# EAGLE design untitled (EAGLE 7.7.0)
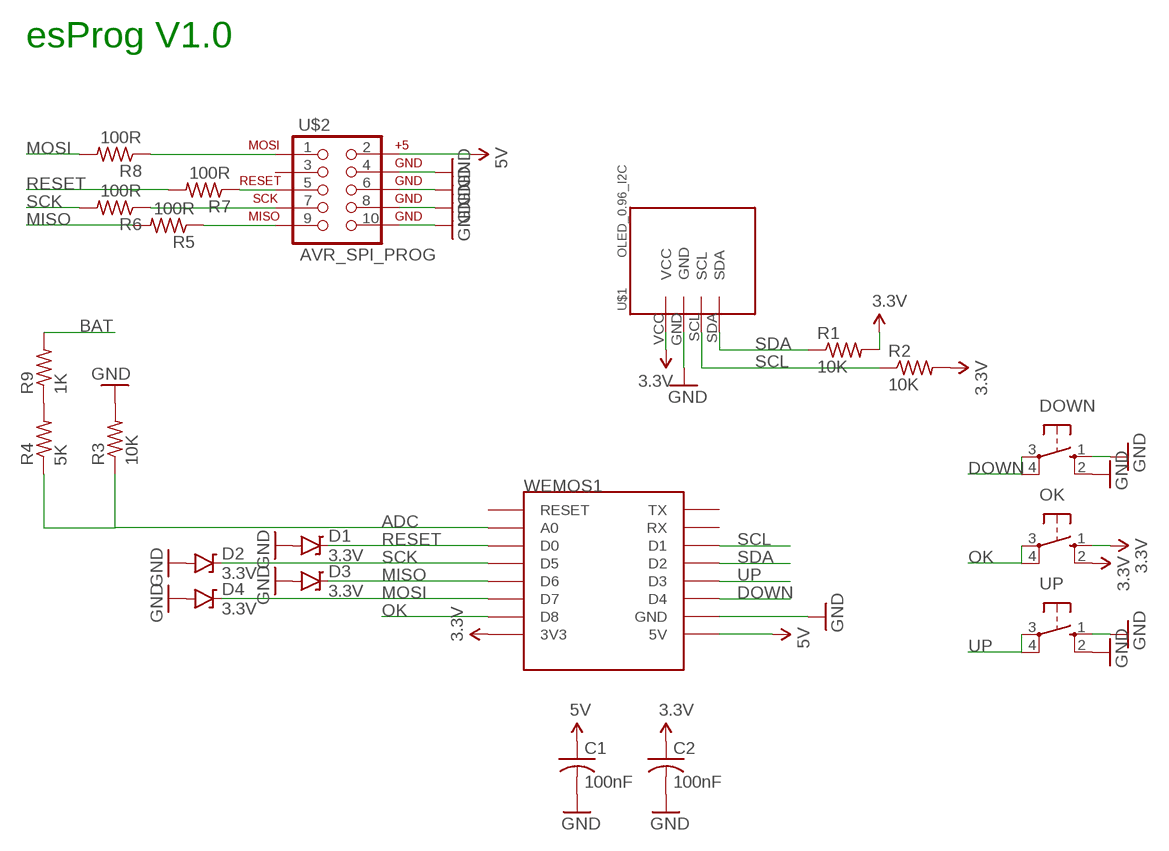
[diagram p0: schematic, sheet 1]

## Parts
C1  100nF  C-USC0805K  [C0805K]
C2  100nF  C-USC0805K  [C0805K]
D1  3.3V  DIODE-ZENER3.3V  [SOD-323]
D2  3.3V  DIODE-ZENER3.3V  [SOD-323]
D3  3.3V  DIODE-ZENER3.3V  [SOD-323]
D4  3.3V  DIODE-ZENER3.3V  [SOD-323]
DOWN  10-XX  [B3F-10XX]
OK  10-XX  [B3F-10XX]
R1  10K  R-US_R0805  [R0805]
R2  10K  R-US_R0805  [R0805]
R3  10K  R-US_R0805  [R0805]
R4  5K  R-US_R0805  [R0805]
R5  100R  R-US_R0805  [R0805]
R6  100R  R-US_R0805  [R0805]
R7  100R  R-US_R0805  [R0805]
R8  100R  R-US_R0805  [R0805]
R9  1K  R-US_R0805  [R0805]
U$1  OLED_0.96_I2C  [OLED_0.96_I2C]
U$2  AVR_SPI_PROG  [AVR_ICSP]
UP  10-XX  [B3F-10XX]
WEMOS1  WEMOS-D1-MINI  [WEMOS-D1-MINI]

## Nets
3.3V: C2.1 OK.1(S) OK.2(S1) R1.2 R2.2 U$1.VCC WEMOS1.3V3
5V: C1.1 U$2.2 WEMOS1.5V
ADC: R3.1 R4.1 WEMOS1.A0
BAT: R9.2
DOWN: DOWN.3(P) DOWN.4(P1) WEMOS1.D4
GND: C1.2 C2.2 D1.A D2.A D3.A D4.A DOWN.1(S) DOWN.2(S1) R3.2 U$1.GND U$2.4 U$2.6 U$2.8 U$2.10 UP.1(S) UP.2(S1) WEMOS1.GND
MISO: D3.C R5.2 WEMOS1.D6
MOSI: D4.C R8.2 WEMOS1.D7
N$1: R8.1 U$2.1
N$2: R7.1 U$2.5
N$3: R6.1 U$2.7
N$4: R5.1 U$2.9
N$5: R4.2 R9.1
OK: OK.3(P) OK.4(P1) WEMOS1.D8
RESET: D1.C R7.2 WEMOS1.D0
SCK: D2.C R6.2 WEMOS1.D5
SCL: R2.1 U$1.SCL WEMOS1.D1
SDA: R1.1 U$1.SDA WEMOS1.D2
UP: UP.3(P) UP.4(P1) WEMOS1.D3
Unconnected: U$2.3 WEMOS1.RESET WEMOS1.RX WEMOS1.TX

## Notes on the sheet
- esProg V1.0

## Library data of the parts
C1 C2 = adafruit:C-US: CAPACITOR, American symbol
D1-D4 = SparkFun-DiscreteSemi:DIODE-ZENER: Zener Diode Production Part - 8199 3.4V Zener Voltage; PROD_ID: DIO-11284
DOWN OK UP = switch-omron:10-XX: OMRON SWITCH; MPN: B3F-1000; OC_FARNELL: 176432; OC_NEWARK: 36M3542
R1-R9 = adafruit:R-US_: RESISTOR, American symbol
U$1 = tft_1.8_1.44_oled_0.96:OLED_0.96_I2C
U$2 = SparkFun-Connectors:AVR_SPI_PROG: AVR 10-pin ICSP Header This is the standard AVR In Circuit Serial Programming header. Minimal, but includes pin one indicator. Works with standard Olimex programmers. Also look for the 6-pin reduced version. Spark Fun Electronics SKU: PRT-00778
WEMOS1 = esp8266modules:WEMOS-D1-MINI: WeMos.cc D1 mini ESP8266 module

## Board
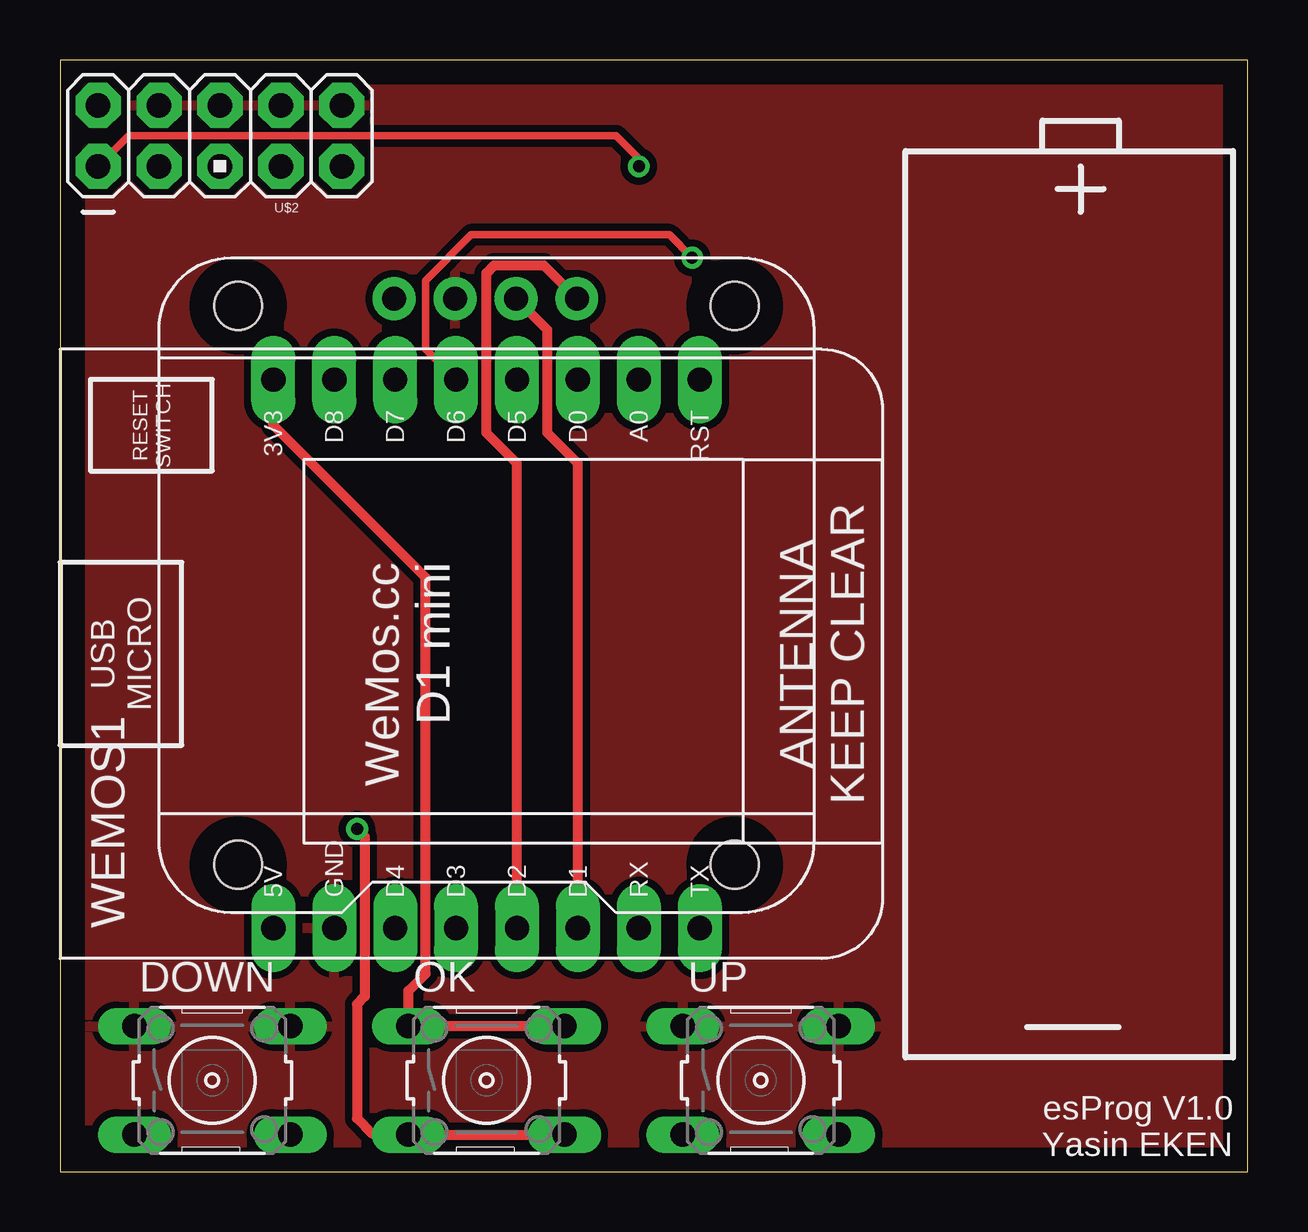
[diagram p1: board, top side]
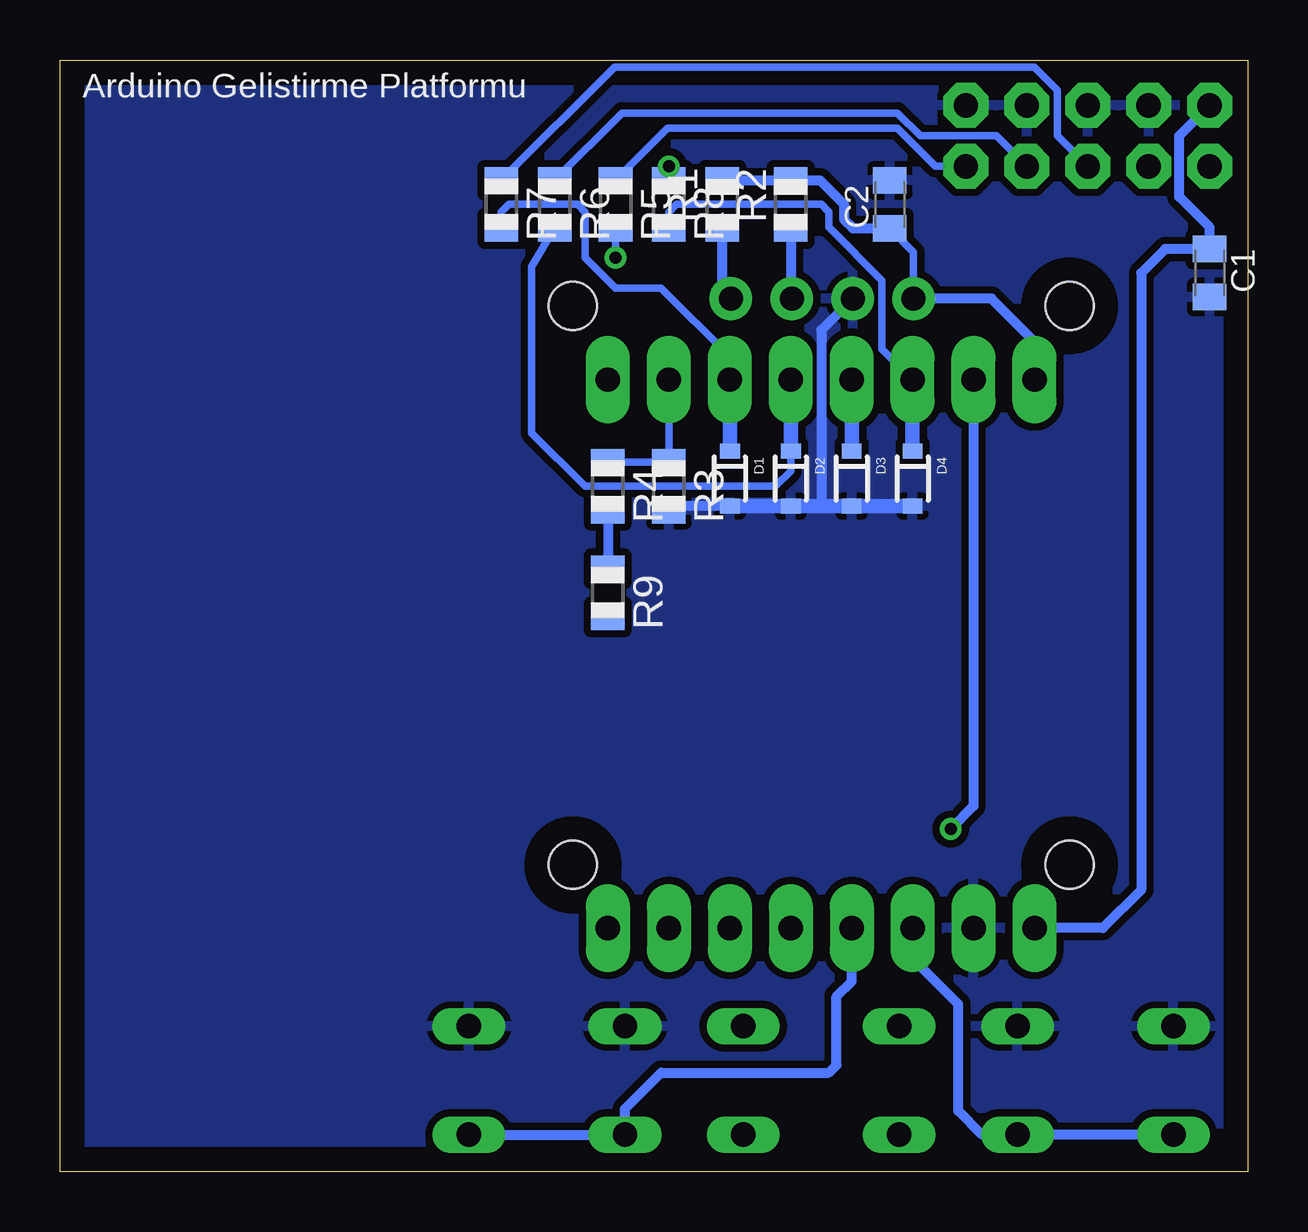
[diagram p2: board, bottom side, seen from below]

Size 49.51 x 46.34 mm. Coordinates in mm from the lower left corner, seen from the top.
Outline: 0,0 49.51,0 49.51,46.34 0,46.34 0,0
Copper layers (1*16): Top 0.035mm / dielectric 1.5mm / Bottom 0.035mm
Design rules "default": minimum track width 10mil, minimum drill 24mil, track to track 8mil, track to pad 8mil, pad to pad 8mil, via to via 8mil, smd to smd 8mil, copper to edge 40mil, drill to drill 8mil, minimum pad ring 10mil, minimum via ring 8mil, stop-mask expansion 4mil, vias tented up to drill 0mil, thermal gap 10mil

### Footprints (pad centres in the part's own frame; a part is rotated, then mirrored left to right if it is on the bottom)
C0805K = smd 1.1 x 1.4: 1 -1,0; 2 1,0
SOD-323 = smd 0.63 x 0.83: A 1.15,0; C -1.15,0
B3F-10XX = drill 1.016 long: 1 -3.251,2.261; 2 3.251,2.261; 3 -3.251,-2.261; 4 3.251,-2.261
R0805 = smd 1.1 x 1.4: 1 -1,0; 2 1,0
OLED_0.96_I2C = drill 1 pad 1.778: GND -1.63,11.63; SCL 0.91,11.63; SDA 3.45,11.63; VCC -4.17,11.63 | hole 2: -10.67,-11.97; 10.03,-11.97; 10.03,11.33; -10.67,11.33
AVR_ICSP = drill 1.016 pad 1.88 octagon: 1 -1.27,5.08; 2 1.27,5.08; 3 -1.27,2.54; 4 1.27,2.54; 5 -1.27,0; 6 1.27,0; 7 -1.27,-2.54; 8 1.27,-2.54; 9 -1.27,-5.08; 10 1.27,-5.08
WEMOS-D1-MINI = drill 1.016 pad 1.829 long: 3V3 -10.16,-10.16; 5V 12.7,-10.16; A0 -10.16,5.08; D0 -10.16,2.54; D1 12.7,2.54; D2 12.7,0; D3 12.7,-2.54; D4 12.7,-5.08; D5 -10.16,0; D6 -10.16,-2.54; D7 -10.16,-5.08; D8 -10.16,-7.62; GND 12.7,-7.62; RESET -10.16,7.62; RX 12.7,5.08; TX 12.7,7.62

### Placement (x,y rotation side)
C1  1.59,37.47 270 bottom
C2  14.92,40.32 90 bottom
D1  21.59,28.89 270 bottom
D2  19.05,28.89 270 bottom
D3  16.51,28.89 270 bottom
D4  13.97,28.89 270 bottom
DOWN  6.35,3.81 0 top
OK  17.78,3.81 0 top
R1  21.91,40.32 90 bottom
R2  19.05,40.32 90 bottom
R3  24.13,28.57 270 bottom
R4  26.67,28.57 270 bottom
R5  26.35,40.32 270 bottom
R6  28.89,40.32 270 bottom
R7  31.11,40.32 270 bottom
R8  24.13,40.32 270 bottom
R9  26.67,24.13 270 bottom
U$1  18.1,24.77 0 top
U$2  6.67,43.18 90 top
UP  29.21,3.81 0 top
WEMOS1  19.05,22.86 270 top

### Tracks (layer width: path | path; a pad name or v marks a point on that pad's centre or on a via)
3.3V
  Top 0.406: OK.2 OK.1 14.53,7.54 15.24,8.26 15.24,24.77 8.89,31.11 WEMOS1.3V3
  Bottom 0.305: C2.1 13.93,38.33 U$1.VCC
  Bottom 0.406: R1.2 R2.2 17.83,41.32 16.83,40.32 16.83,39.69 16.46,39.32 C2.1 | WEMOS1.3V3 8.89,34.61 10.68,36.4 U$1.VCC
5V
  Bottom 0.406: U$2.2 2.86,43.18 2.86,40.64 1.59,39.37 C1.1 3.44,38.47 4.45,37.47 4.45,11.75 6.03,10.16 WEMOS1.5V
ADC
  Bottom 0.305: WEMOS1.A0 R3.1 R4.1
DOWN
  Bottom 0.406: DOWN.3 DOWN.4 11.07,1.55 12.06,2.54 12.06,6.99 13.97,8.89 WEMOS1.D4
GND
  Bottom 0.406: U$1.GND 17.78,35.08 17.78,27.74 | D1.A 23.96,27.74 arc-90 R3.2
  Bottom 0.61: D1.A D2.A 17.78,27.74 D3.A D4.A
  pour Top (isolate 0.305): 0,0 49.53,0 49.53,46.35 0,46.35
  pour Bottom (isolate 0.305): 0,0 49.53,0 49.53,46.35 0,46.35
MISO  (via drill 0.5)
  Top 0.305: WEMOS1.D6 15.24,34.29 15.24,37.15 17.14,39.05 25.4,39.05 v26.35,38.1
  Bottom 0.305: v26.35,38.1 R5.2
  Bottom 0.61: WEMOS1.D6 D3.C
MOSI
  Bottom 0.305: R8.2 24.13,40.01 23.81,40.32 17.78,40.32 17.46,40.01 17.46,39.37 15.24,37.15 15.24,34.29 WEMOS1.D7
  Bottom 0.61: D4.C WEMOS1.D7
N$1  (via drill 0.5)
  Top 0.305: U$2.1 2.86,43.18 23.18,43.18 24.13,42.23 v24.13,41.91
  Bottom 0.305: v24.13,41.91 R8.1
N$2
  Bottom 0.305: R7.1 26.4,46.04 8.89,46.04 7.94,45.09 7.94,43.18 U$2.5
N$3
  Bottom 0.305: R6.1 26.08,44.13 14.61,44.13 13.65,43.18 10.48,43.18 U$2.7
N$4
  Bottom 0.305: R5.1 24.18,43.5 14.61,43.5 13.02,41.91 U$2.9
N$5
  Bottom 0.406: R4.2 R9.1
OK  (via drill 0.5)
  Top 0.406: v12.38,14.29 12.7,13.97 12.7,7.3 12.38,6.99 12.38,2.22 13.02,1.59 14.49,1.59 OK.3 OK.4
  Bottom 0.406: WEMOS1.D8 11.43,15.24 v12.38,14.29
RESET
  Bottom 0.305: WEMOS1.D0 21.59,33.97 24.45,36.83 26.35,36.83 27.62,38.1 27.62,40.01 27.94,40.32 30.8,40.32 31.11,40.01 R7.2
  Bottom 0.61: WEMOS1.D0 D1.C
SCK
  Bottom 0.305: R6.2 29.84,37.73 29.84,30.8 27.62,28.57 19.68,28.57 19.05,29.21 D2.C
  Bottom 0.61: WEMOS1.D5 D2.C
SCL
  Top 0.406: WEMOS1.D1 21.59,29.53 20.32,30.8 20.32,35.08 U$1.SCL
  Bottom 0.406: R2.1 19.05,36.44 U$1.SCL
SDA
  Top 0.406: WEMOS1.D2 19.05,29.53 17.78,30.8 17.78,37.47 18.1,37.78 20.16,37.78 U$1.SDA
  Bottom 0.406: R1.1 21.91,36.76 U$1.SDA
UP
  Bottom 0.406: WEMOS1.D3 16.51,7.94 17.14,7.3 17.14,4.45 17.46,4.13 24.45,4.13 25.96,2.62 UP.3 UP.4

### Text on the board
tPlace: esProg V1.0 / Yasin EKEN
bPlace: Arduino Gelistirme Platformu